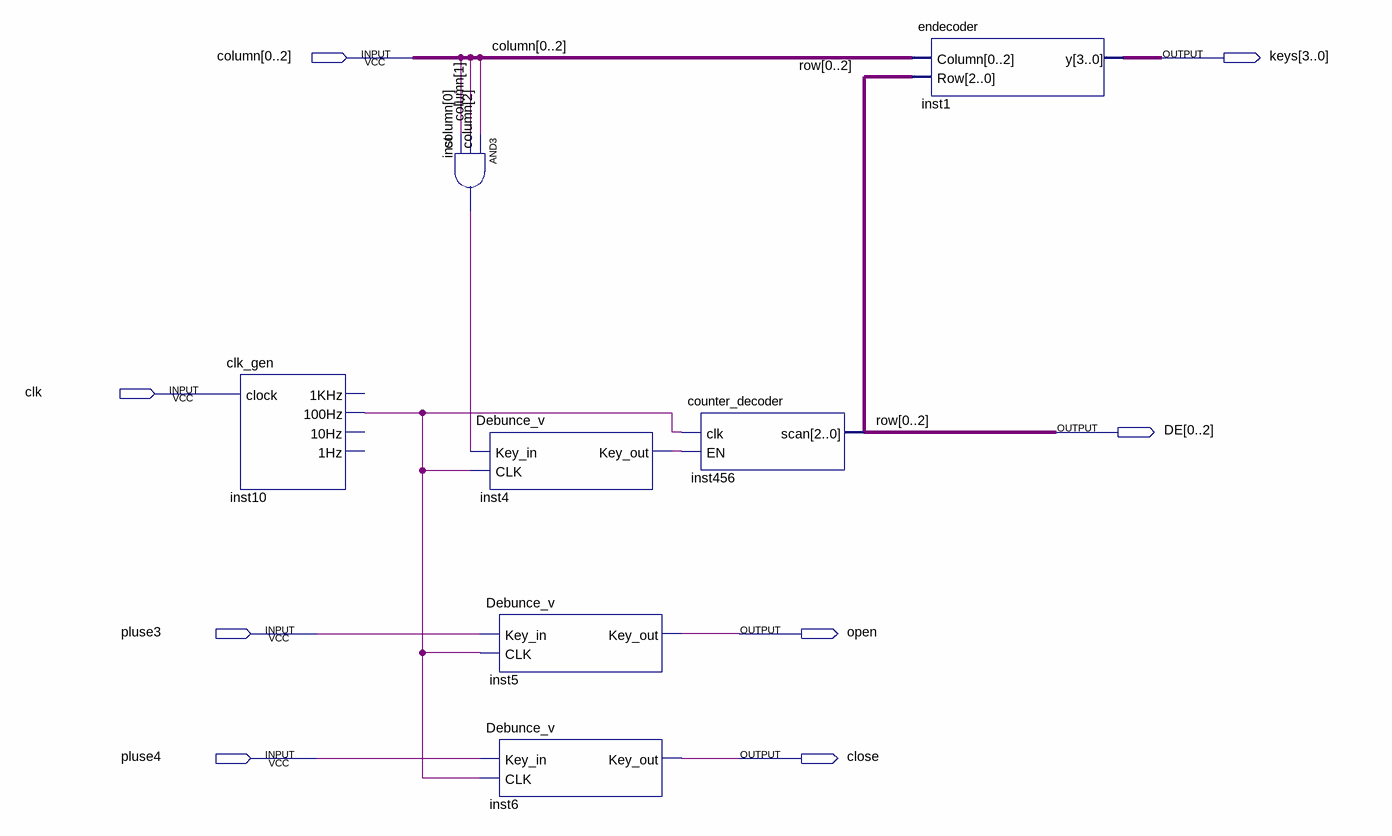
[diagram p0: schematic sheet]
// Quartus schematic insideinput.bdf as structural Verilog: 7 symbols, 8 pins
module insideinput (
  input  [0:2] column,
  input  clk,
  input  pluse3,
  input  pluse4,
  output [3:0] keys,
  output [0:2] DE,
  output open,
  output close
);

  wire inst4_key_out, inst10_100hz, inst_out;

  clk_gen inst10 (.clock(clk), .\100Hz (inst10_100hz));  // open: 1KHz, 10Hz, 1Hz
  and inst (inst_out, column[2], column[1], column[0]);
  Debunce_v inst4 (.Key_in(inst_out), .CLK(inst10_100hz), .Key_out(inst4_key_out));
  Debunce_v inst5 (.Key_in(pluse3), .CLK(inst10_100hz), .Key_out(open));
  Debunce_v inst6 (.Key_in(pluse4), .CLK(inst10_100hz), .Key_out(close));
  counter_decoder inst456 (.clk(inst10_100hz), .EN(inst4_key_out), .scan(DE));
  endecoder inst1 (.Column(column), .Row(DE), .y(keys));

  // Other names for the same wires on the sheet: row[2:0] = {DE[2], DE[1], DE[0]}
endmodule
